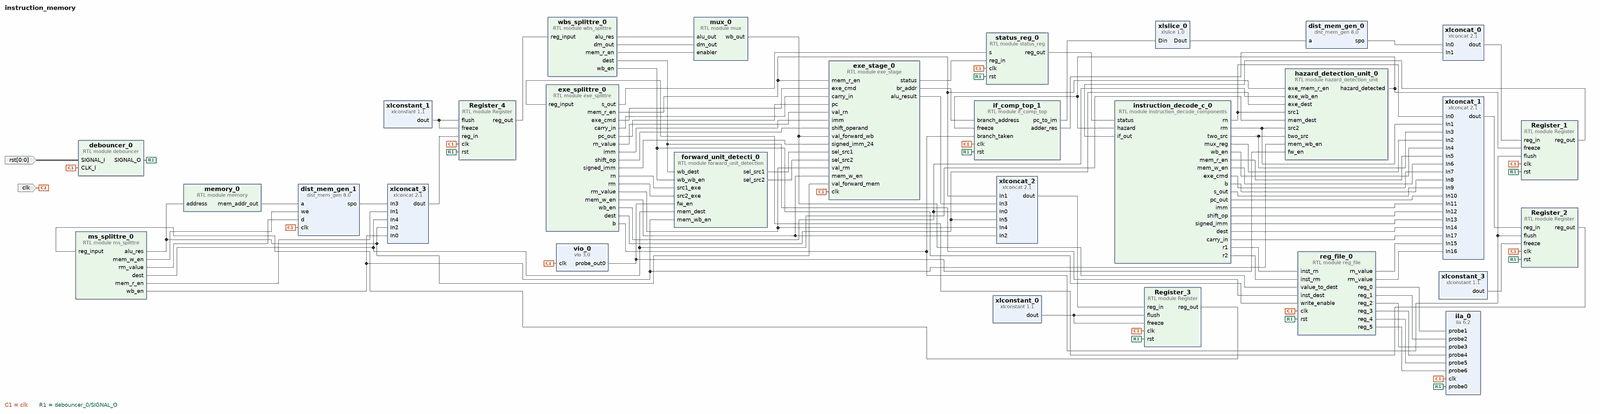
[diagram p0: block diagram of the top level, whole]
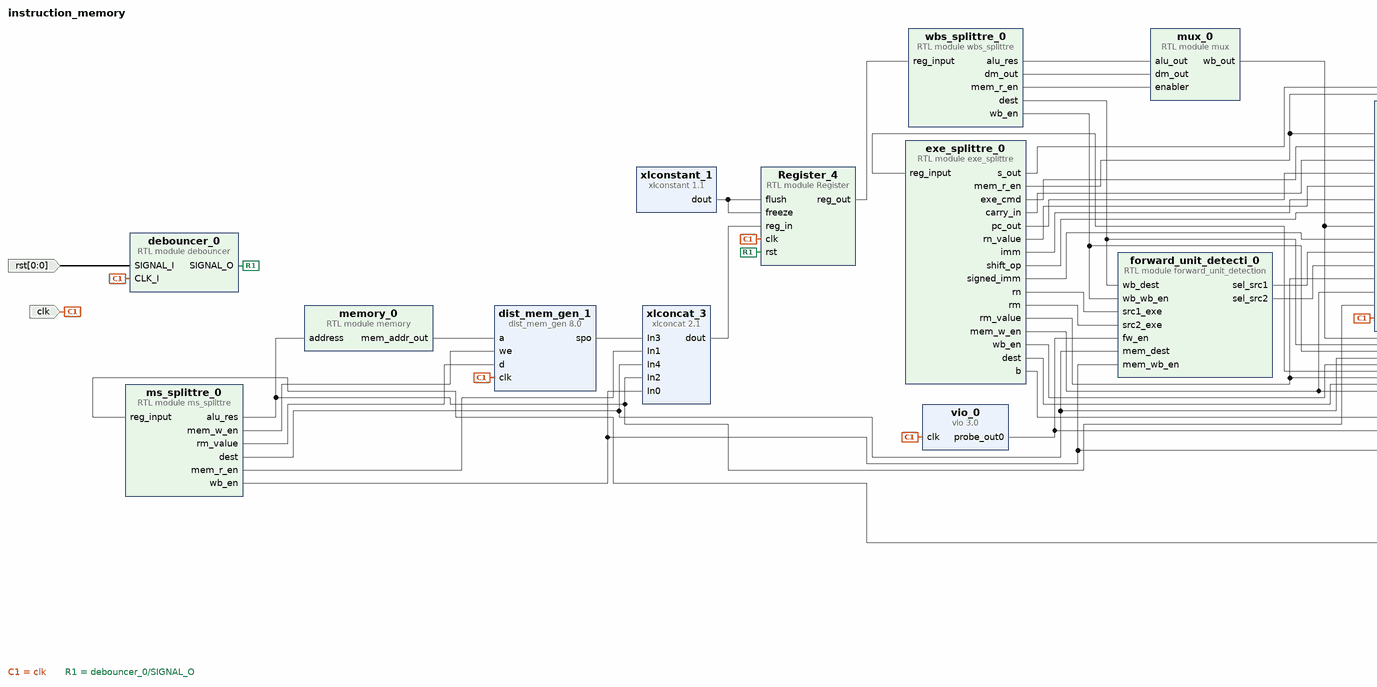
[diagram p1: block diagram of the top level, left part]
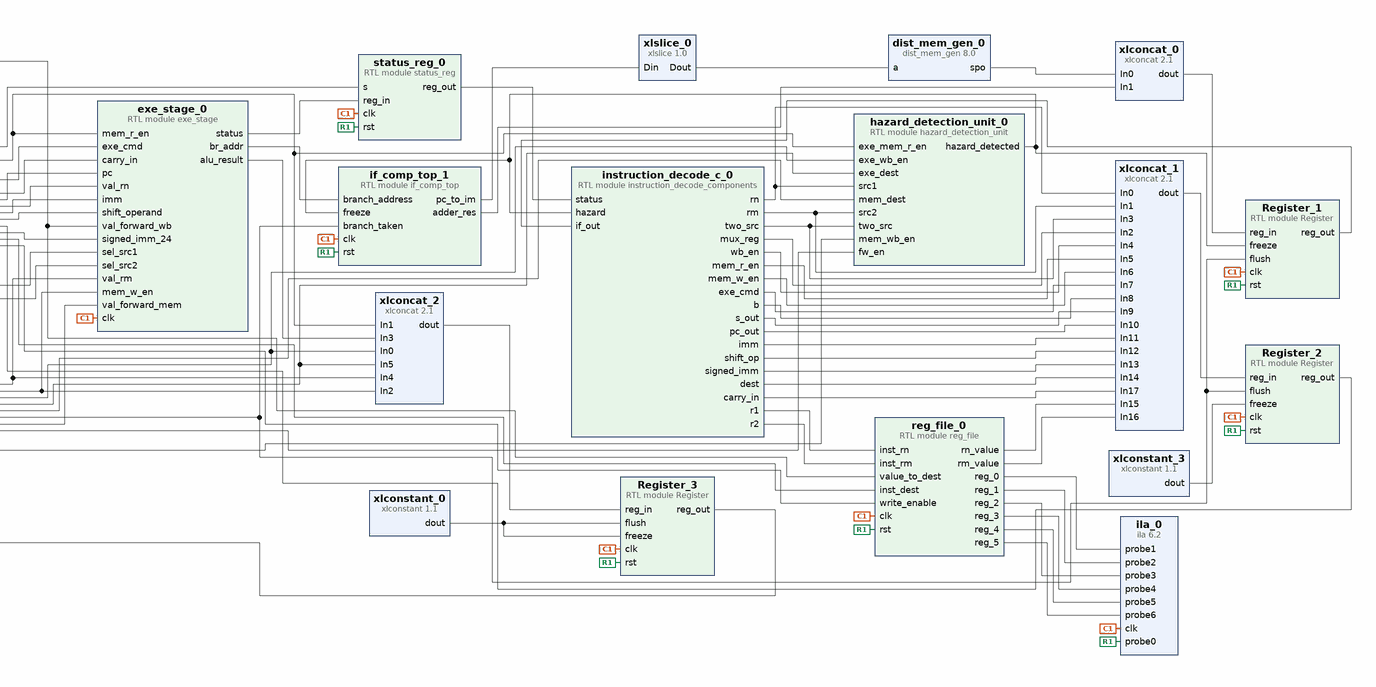
[diagram p2: block diagram of the top level, right part]
# Vivado block design instruction_memory, xc7z010clg400-1, Vivado 2018.3
create_bd_design instruction_memory

create_bd_port -dir I clk
create_bd_port -dir I -from 0 -to 0 rst

create_bd_cell -type ip -vlnv xilinx.com:ip:xlslice:1.0 xlslice_0
set_property -dict {CONFIG.DIN_FROM 12 CONFIG.DIN_TO 0 CONFIG.DOUT_WIDTH 13} [get_bd_cells xlslice_0]
create_bd_cell -type ip -vlnv xilinx.com:ip:xlconcat:2.1 xlconcat_0
set_property -dict {CONFIG.IN0_WIDTH 32 CONFIG.IN1_WIDTH 32} [get_bd_cells xlconcat_0]
create_bd_cell -type ip -vlnv xilinx.com:ip:ila:6.2 ila_0
set_property -dict [list \
  CONFIG.C_DATA_DEPTH 1024 \
  CONFIG.C_ENABLE_ILA_AXI_MON false \
  CONFIG.C_MONITOR_TYPE Native \
  CONFIG.C_NUM_OF_PROBES 7 \
  CONFIG.C_PROBE0_TYPE 0 \
  CONFIG.C_PROBE10_WIDTH 1 \
  CONFIG.C_PROBE11_WIDTH 1 \
  CONFIG.C_PROBE12_WIDTH 1 \
  CONFIG.C_PROBE13_WIDTH 1 \
  CONFIG.C_PROBE14_WIDTH 1 \
  CONFIG.C_PROBE15_WIDTH 1 \
  CONFIG.C_PROBE16_WIDTH 1 \
  CONFIG.C_PROBE1_TYPE 1 \
  CONFIG.C_PROBE1_WIDTH 32 \
  CONFIG.C_PROBE2_TYPE 1 \
  CONFIG.C_PROBE2_WIDTH 32 \
  CONFIG.C_PROBE3_TYPE 1 \
  CONFIG.C_PROBE3_WIDTH 32 \
  CONFIG.C_PROBE4_TYPE 1 \
  CONFIG.C_PROBE4_WIDTH 32 \
  CONFIG.C_PROBE5_TYPE 1 \
  CONFIG.C_PROBE5_WIDTH 32 \
  CONFIG.C_PROBE6_TYPE 1 \
  CONFIG.C_PROBE6_WIDTH 32 \
  CONFIG.C_PROBE7_TYPE 0 \
  CONFIG.C_PROBE7_WIDTH 1 \
  CONFIG.C_PROBE8_WIDTH 1 \
  CONFIG.C_PROBE9_WIDTH 1 \
] [get_bd_cells ila_0]
create_bd_cell -type ip -vlnv xilinx.com:ip:xlconcat:2.1 xlconcat_1
set_property -dict [list \
  CONFIG.IN0_WIDTH 4 \
  CONFIG.IN10_WIDTH 32 \
  CONFIG.IN11_WIDTH 1 \
  CONFIG.IN12_WIDTH 12 \
  CONFIG.IN13_WIDTH 24 \
  CONFIG.IN14_WIDTH 4 \
  CONFIG.IN15_WIDTH 32 \
  CONFIG.IN16_WIDTH 32 \
  CONFIG.IN17_WIDTH 1 \
  CONFIG.IN1_WIDTH 4 \
  CONFIG.IN2_WIDTH 4 \
  CONFIG.IN3_WIDTH 1 \
  CONFIG.IN4_WIDTH 1 \
  CONFIG.IN5_WIDTH 1 \
  CONFIG.IN6_WIDTH 1 \
  CONFIG.IN7_WIDTH 4 \
  CONFIG.IN8_WIDTH 1 \
  CONFIG.IN9_WIDTH 1 \
  CONFIG.NUM_PORTS 18 \
] [get_bd_cells xlconcat_1]
create_bd_cell -type ip -vlnv xilinx.com:ip:dist_mem_gen:8.0 dist_mem_gen_0
set_property -dict [list \
  CONFIG.coefficient_file c:/Users/Ali/Downloads/output.coe \
  CONFIG.data_width 32 \
  CONFIG.default_data_radix 2 \
  CONFIG.depth 8192 \
  CONFIG.memory_type rom \
] [get_bd_cells dist_mem_gen_0]
create_bd_cell -type ip -vlnv xilinx.com:ip:xlconcat:2.1 xlconcat_2
set_property -dict [list \
  CONFIG.IN3_WIDTH 32 \
  CONFIG.IN4_WIDTH 32 \
  CONFIG.IN5_WIDTH 4 \
  CONFIG.IN6_WIDTH 4 \
  CONFIG.NUM_PORTS 6 \
] [get_bd_cells xlconcat_2]
create_bd_cell -type ip -vlnv xilinx.com:ip:xlconcat:2.1 xlconcat_3
set_property -dict [list \
  CONFIG.IN2_WIDTH 32 \
  CONFIG.IN3_WIDTH 32 \
  CONFIG.IN4_WIDTH 4 \
  CONFIG.IN5_WIDTH 4 \
  CONFIG.IN6_WIDTH 4 \
  CONFIG.NUM_PORTS 5 \
] [get_bd_cells xlconcat_3]
create_bd_cell -type ip -vlnv xilinx.com:ip:xlconstant:1.1 xlconstant_0
set_property -dict {CONFIG.CONST_VAL 0} [get_bd_cells xlconstant_0]
create_bd_cell -type ip -vlnv xilinx.com:ip:xlconstant:1.1 xlconstant_1
set_property -dict {CONFIG.CONST_VAL 0} [get_bd_cells xlconstant_1]
create_bd_cell -type ip -vlnv xilinx.com:ip:dist_mem_gen:8.0 dist_mem_gen_1
set_property -dict {CONFIG.data_width 32 CONFIG.depth 1024 CONFIG.memory_type single_port_ram} [get_bd_cells dist_mem_gen_1]
create_bd_cell -type module -reference exe_splittre exe_splittre_0
create_bd_cell -type module -reference ms_splittre ms_splittre_0
create_bd_cell -type module -reference wbs_splittre wbs_splittre_0
create_bd_cell -type module -reference mux mux_0
create_bd_cell -type module -reference status_reg status_reg_0
create_bd_cell -type module -reference Register Register_2
set_property -dict {CONFIG.size 160} [get_bd_cells Register_2]
create_bd_cell -type module -reference Register Register_1
set_property -dict {CONFIG.size 64} [get_bd_cells Register_1]
create_bd_cell -type module -reference Register Register_3
set_property -dict {CONFIG.size 71} [get_bd_cells Register_3]
create_bd_cell -type module -reference Register Register_4
set_property -dict {CONFIG.size 70} [get_bd_cells Register_4]
create_bd_cell -type ip -vlnv xilinx.com:ip:xlconstant:1.1 xlconstant_3
set_property -dict {CONFIG.CONST_VAL 0} [get_bd_cells xlconstant_3]
create_bd_cell -type module -reference memory memory_0
create_bd_cell -type module -reference if_comp_top if_comp_top_1
create_bd_cell -type module -reference instruction_decode_components instruction_decode_c_0
create_bd_cell -type module -reference debouncer debouncer_0
create_bd_cell -type module -reference reg_file reg_file_0
create_bd_cell -type module -reference exe_stage exe_stage_0
create_bd_cell -type module -reference hazard_detection_unit hazard_detection_unit_0
create_bd_cell -type module -reference forward_unit_detection forward_unit_detecti_0
create_bd_cell -type ip -vlnv xilinx.com:ip:vio:3.0 vio_0
set_property -dict {CONFIG.C_NUM_PROBE_IN 0 CONFIG.C_PROBE_OUT0_INIT_VAL 0x1} [get_bd_cells vio_0]

# ---- connections ----

connect_bd_net [get_bd_pins xlconcat_0/dout] [get_bd_pins Register_1/reg_in]
connect_bd_net [get_bd_ports clk] \
  [get_bd_pins ila_0/clk] [get_bd_pins dist_mem_gen_1/clk] [get_bd_pins status_reg_0/clk] [get_bd_pins Register_2/clk] \
  [get_bd_pins Register_1/clk] [get_bd_pins Register_3/clk] [get_bd_pins Register_4/clk] [get_bd_pins if_comp_top_1/clk] \
  [get_bd_pins debouncer_0/CLK_I] [get_bd_pins reg_file_0/clk] [get_bd_pins exe_stage_0/clk] [get_bd_pins vio_0/clk]
connect_bd_net [get_bd_pins Register_1/reg_out] [get_bd_pins instruction_decode_c_0/if_out]
connect_bd_net [get_bd_pins instruction_decode_c_0/r1] [get_bd_pins reg_file_0/inst_rn]
connect_bd_net [get_bd_pins instruction_decode_c_0/r2] [get_bd_pins reg_file_0/inst_rm]
connect_bd_net [get_bd_pins instruction_decode_c_0/rn] [get_bd_pins xlconcat_1/In0] [get_bd_pins hazard_detection_unit_0/src1]
connect_bd_net [get_bd_pins instruction_decode_c_0/rm] [get_bd_pins xlconcat_1/In1] [get_bd_pins hazard_detection_unit_0/src2]
connect_bd_net [get_bd_pins instruction_decode_c_0/two_src] [get_bd_pins xlconcat_1/In3] [get_bd_pins hazard_detection_unit_0/two_src]
connect_bd_net [get_bd_pins instruction_decode_c_0/mux_reg] [get_bd_pins xlconcat_1/In2]
connect_bd_net [get_bd_pins instruction_decode_c_0/wb_en] [get_bd_pins xlconcat_1/In4]
connect_bd_net [get_bd_pins instruction_decode_c_0/mem_r_en] [get_bd_pins xlconcat_1/In5]
connect_bd_net [get_bd_pins instruction_decode_c_0/mem_w_en] [get_bd_pins xlconcat_1/In6]
connect_bd_net [get_bd_pins instruction_decode_c_0/exe_cmd] [get_bd_pins xlconcat_1/In7]
connect_bd_net [get_bd_pins instruction_decode_c_0/b] [get_bd_pins xlconcat_1/In8]
connect_bd_net [get_bd_pins instruction_decode_c_0/s_out] [get_bd_pins xlconcat_1/In9]
connect_bd_net [get_bd_pins instruction_decode_c_0/pc_out] [get_bd_pins xlconcat_1/In10]
connect_bd_net [get_bd_pins instruction_decode_c_0/imm] [get_bd_pins xlconcat_1/In11]
connect_bd_net [get_bd_pins instruction_decode_c_0/shift_op] [get_bd_pins xlconcat_1/In12]
connect_bd_net [get_bd_pins instruction_decode_c_0/signed_imm] [get_bd_pins xlconcat_1/In13]
connect_bd_net [get_bd_pins instruction_decode_c_0/dest] [get_bd_pins xlconcat_1/In14]
connect_bd_net [get_bd_pins reg_file_0/rn_value] [get_bd_pins xlconcat_1/In15]
connect_bd_net [get_bd_pins reg_file_0/rm_value] [get_bd_pins xlconcat_1/In16]
connect_bd_net [get_bd_pins xlconcat_1/dout] [get_bd_pins Register_2/reg_in]
connect_bd_net [get_bd_pins xlslice_0/Dout] [get_bd_pins dist_mem_gen_0/a]
connect_bd_net [get_bd_pins dist_mem_gen_0/spo] [get_bd_pins xlconcat_0/In0]
connect_bd_net [get_bd_pins if_comp_top_1/pc_to_im] [get_bd_pins xlslice_0/Din]
connect_bd_net [get_bd_pins if_comp_top_1/adder_res] [get_bd_pins xlconcat_0/In1]
connect_bd_net [get_bd_pins Register_2/reg_out] [get_bd_pins exe_splittre_0/reg_input]
connect_bd_net [get_bd_pins exe_splittre_0/exe_cmd] [get_bd_pins exe_stage_0/exe_cmd]
connect_bd_net [get_bd_pins exe_splittre_0/mem_r_en] \
  [get_bd_pins xlconcat_2/In1] [get_bd_pins exe_stage_0/mem_r_en] [get_bd_pins hazard_detection_unit_0/exe_mem_r_en]
connect_bd_net [get_bd_pins exe_splittre_0/carry_in] [get_bd_pins exe_stage_0/carry_in]
connect_bd_net [get_bd_pins exe_splittre_0/pc_out] [get_bd_pins exe_stage_0/pc]
connect_bd_net [get_bd_pins exe_splittre_0/rn_value] [get_bd_pins exe_stage_0/val_rn]
connect_bd_net [get_bd_pins exe_splittre_0/rm_value] [get_bd_pins xlconcat_2/In4] [get_bd_pins exe_stage_0/val_rm]
connect_bd_net [get_bd_pins exe_splittre_0/imm] [get_bd_pins exe_stage_0/imm]
connect_bd_net [get_bd_pins exe_splittre_0/shift_op] [get_bd_pins exe_stage_0/shift_operand]
connect_bd_net [get_bd_pins exe_splittre_0/signed_imm] [get_bd_pins exe_stage_0/signed_imm_24]
connect_bd_net [get_bd_pins exe_splittre_0/wb_en] [get_bd_pins xlconcat_2/In0] [get_bd_pins hazard_detection_unit_0/exe_wb_en]
connect_bd_net [get_bd_pins exe_stage_0/alu_result] [get_bd_pins xlconcat_2/In3]
connect_bd_net [get_bd_pins exe_splittre_0/dest] [get_bd_pins xlconcat_2/In5] [get_bd_pins hazard_detection_unit_0/exe_dest]
connect_bd_net [get_bd_pins exe_stage_0/br_addr] [get_bd_pins if_comp_top_1/branch_address]
connect_bd_net [get_bd_pins xlconcat_2/dout] [get_bd_pins Register_3/reg_in]
connect_bd_net [get_bd_pins Register_3/reg_out] [get_bd_pins ms_splittre_0/reg_input]
connect_bd_net [get_bd_pins Register_4/reg_out] [get_bd_pins wbs_splittre_0/reg_input]
connect_bd_net [get_bd_pins exe_stage_0/status] [get_bd_pins status_reg_0/reg_in]
connect_bd_net [get_bd_pins exe_splittre_0/s_out] [get_bd_pins status_reg_0/s]
connect_bd_net [get_bd_pins status_reg_0/reg_out] [get_bd_pins instruction_decode_c_0/status]
connect_bd_net [get_bd_pins instruction_decode_c_0/carry_in] [get_bd_pins xlconcat_1/In17]
connect_bd_net [get_bd_pins ms_splittre_0/dest] \
  [get_bd_pins xlconcat_3/In4] [get_bd_pins hazard_detection_unit_0/mem_dest] [get_bd_pins forward_unit_detecti_0/mem_dest]
connect_bd_net [get_bd_pins ms_splittre_0/wb_en] \
  [get_bd_pins xlconcat_3/In0] [get_bd_pins hazard_detection_unit_0/mem_wb_en] [get_bd_pins forward_unit_detecti_0/mem_wb_en]
connect_bd_net [get_bd_pins exe_splittre_0/b] [get_bd_pins Register_2/flush] [get_bd_pins Register_1/flush] [get_bd_pins if_comp_top_1/branch_taken]
connect_bd_net [get_bd_pins wbs_splittre_0/alu_res] [get_bd_pins mux_0/alu_out]
connect_bd_net [get_bd_pins wbs_splittre_0/dm_out] [get_bd_pins mux_0/dm_out]
connect_bd_net [get_bd_pins wbs_splittre_0/mem_r_en] [get_bd_pins mux_0/enabler]
connect_bd_net [get_bd_pins mux_0/wb_out] [get_bd_pins reg_file_0/value_to_dest] [get_bd_pins exe_stage_0/val_forward_wb]
connect_bd_net [get_bd_pins wbs_splittre_0/dest] [get_bd_pins reg_file_0/inst_dest] [get_bd_pins forward_unit_detecti_0/wb_dest]
connect_bd_net [get_bd_pins wbs_splittre_0/wb_en] [get_bd_pins reg_file_0/write_enable] [get_bd_pins forward_unit_detecti_0/wb_wb_en]
connect_bd_net [get_bd_pins ms_splittre_0/mem_r_en] [get_bd_pins xlconcat_3/In1]
connect_bd_net [get_bd_pins xlconcat_3/dout] [get_bd_pins Register_4/reg_in]
connect_bd_net [get_bd_pins xlconstant_0/dout] [get_bd_pins Register_3/flush] [get_bd_pins Register_3/freeze]
connect_bd_net [get_bd_pins xlconstant_1/dout] [get_bd_pins Register_4/flush] [get_bd_pins Register_4/freeze]
connect_bd_net [get_bd_pins hazard_detection_unit_0/hazard_detected] \
  [get_bd_pins Register_1/freeze] [get_bd_pins if_comp_top_1/freeze] [get_bd_pins instruction_decode_c_0/hazard]
connect_bd_net [get_bd_pins ms_splittre_0/mem_w_en] [get_bd_pins dist_mem_gen_1/we]
connect_bd_net [get_bd_pins dist_mem_gen_1/spo] [get_bd_pins xlconcat_3/In3]
connect_bd_net [get_bd_pins memory_0/mem_addr_out] [get_bd_pins dist_mem_gen_1/a]
connect_bd_net [get_bd_pins xlconstant_3/dout] [get_bd_pins Register_2/freeze]
connect_bd_net [get_bd_pins ms_splittre_0/alu_res] \
  [get_bd_pins memory_0/address] [get_bd_pins xlconcat_3/In2] [get_bd_pins exe_stage_0/val_forward_mem]
connect_bd_net [get_bd_pins ms_splittre_0/rm_value] [get_bd_pins dist_mem_gen_1/d]
connect_bd_net [get_bd_ports rst] [get_bd_pins debouncer_0/SIGNAL_I]
connect_bd_net [get_bd_pins debouncer_0/SIGNAL_O] \
  [get_bd_pins if_comp_top_1/rst] [get_bd_pins Register_1/rst] [get_bd_pins Register_2/rst] [get_bd_pins status_reg_0/rst] \
  [get_bd_pins Register_3/rst] [get_bd_pins Register_4/rst] [get_bd_pins ila_0/probe0] [get_bd_pins reg_file_0/rst]
connect_bd_net [get_bd_pins reg_file_0/reg_0] [get_bd_pins ila_0/probe1]
connect_bd_net [get_bd_pins reg_file_0/reg_1] [get_bd_pins ila_0/probe2]
connect_bd_net [get_bd_pins reg_file_0/reg_2] [get_bd_pins ila_0/probe3]
connect_bd_net [get_bd_pins reg_file_0/reg_3] [get_bd_pins ila_0/probe4]
connect_bd_net [get_bd_pins reg_file_0/reg_4] [get_bd_pins ila_0/probe5]
connect_bd_net [get_bd_pins reg_file_0/reg_5] [get_bd_pins ila_0/probe6]
connect_bd_net [get_bd_pins exe_splittre_0/rn] [get_bd_pins forward_unit_detecti_0/src1_exe]
connect_bd_net [get_bd_pins exe_splittre_0/rm] [get_bd_pins forward_unit_detecti_0/src2_exe]
connect_bd_net [get_bd_pins forward_unit_detecti_0/sel_src1] [get_bd_pins exe_stage_0/sel_src1]
connect_bd_net [get_bd_pins forward_unit_detecti_0/sel_src2] [get_bd_pins exe_stage_0/sel_src2]
connect_bd_net -net xlconstant_2_dout [get_bd_pins vio_0/probe_out0] \
  [get_bd_pins hazard_detection_unit_0/fw_en] [get_bd_pins forward_unit_detecti_0/fw_en]
connect_bd_net [get_bd_pins exe_splittre_0/mem_w_en] [get_bd_pins exe_stage_0/mem_w_en] [get_bd_pins xlconcat_2/In2]

validate_bd_design
save_bd_design
